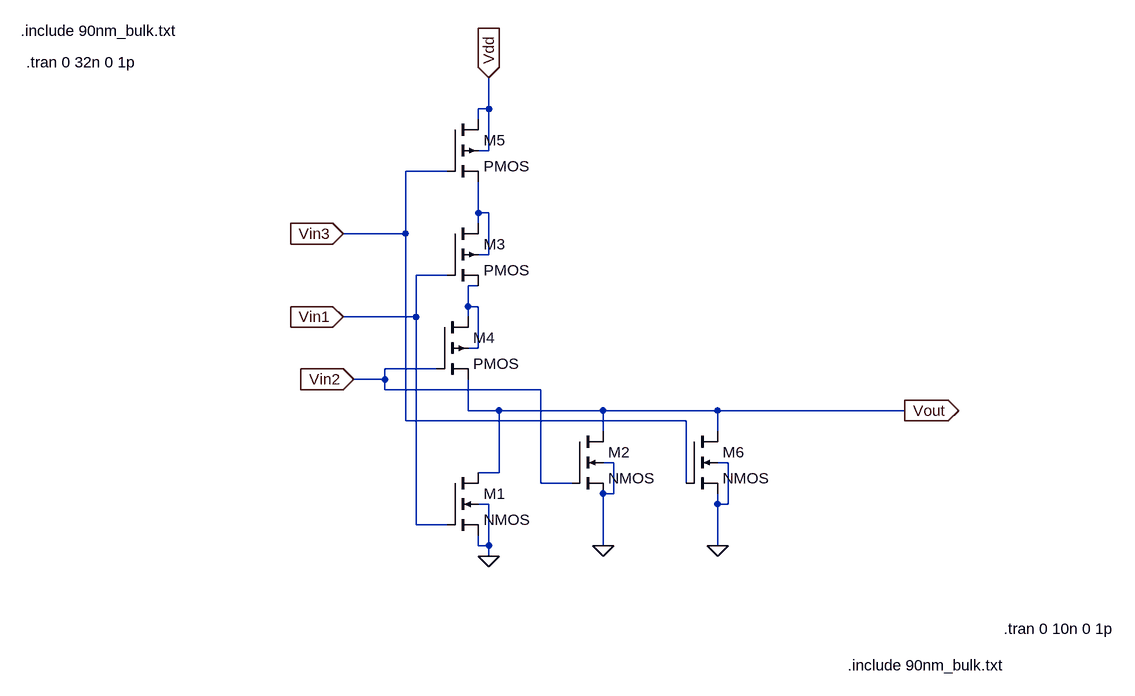
[diagram p0: schematic nor3.asc]
nor3.asc, the LTspice schematic file:
Version 4
SHEET 1 968 680
WIRE -720 -592 -720 -640
WIRE -720 -592 -736 -592
WIRE -736 -576 -736 -592
WIRE -720 -528 -720 -592
WIRE -720 -528 -736 -528
WIRE -784 -496 -848 -496
WIRE -736 -432 -736 -480
WIRE -720 -432 -736 -432
WIRE -736 -416 -736 -432
WIRE -848 -400 -848 -496
WIRE -848 -400 -944 -400
WIRE -720 -368 -720 -432
WIRE -720 -368 -736 -368
WIRE -784 -336 -832 -336
WIRE -736 -320 -752 -320
WIRE -752 -288 -752 -320
WIRE -736 -288 -752 -288
WIRE -832 -272 -832 -336
WIRE -832 -272 -944 -272
WIRE -752 -272 -752 -288
WIRE -736 -224 -736 -288
WIRE -736 -224 -752 -224
WIRE -800 -192 -880 -192
WIRE -880 -176 -880 -192
WIRE -880 -176 -928 -176
WIRE -880 -160 -880 -176
WIRE -640 -160 -880 -160
WIRE -752 -128 -752 -176
WIRE -704 -128 -752 -128
WIRE -544 -128 -704 -128
WIRE -368 -128 -544 -128
WIRE -80 -128 -368 -128
WIRE -848 -112 -848 -400
WIRE -416 -112 -848 -112
WIRE -544 -96 -544 -128
WIRE -368 -96 -368 -128
WIRE -528 -48 -544 -48
WIRE -352 -48 -368 -48
WIRE -704 -32 -704 -128
WIRE -704 -32 -736 -32
WIRE -640 -16 -640 -160
WIRE -592 -16 -640 -16
WIRE -416 -16 -416 -112
WIRE -528 0 -528 -48
WIRE -528 0 -544 0
WIRE -720 16 -736 16
WIRE -368 16 -368 0
WIRE -352 16 -352 -48
WIRE -352 16 -368 16
WIRE -832 48 -832 -272
WIRE -784 48 -832 48
WIRE -736 80 -736 64
WIRE -720 80 -720 16
WIRE -720 80 -736 80
WIRE -544 80 -544 0
WIRE -368 80 -368 16
WIRE -720 96 -720 80
FLAG -944 -272 Vin1
IOPIN -944 -272 In
FLAG -928 -176 Vin2
IOPIN -928 -176 In
FLAG -80 -128 Vout
IOPIN -80 -128 Out
FLAG -720 -640 Vdd
IOPIN -720 -640 In
FLAG -944 -400 Vin3
IOPIN -944 -400 In
FLAG -368 80 0
FLAG -544 80 0
FLAG -720 96 0
SYMBOL nmos4 -784 -32 R0
SYMATTR InstName M1
SYMATTR Value2 l=90n w=200n
SYMBOL nmos4 -592 -96 R0
SYMATTR InstName M2
SYMATTR Value2 l=90n w=200n
SYMBOL pmos4 -784 -416 R0
SYMATTR InstName M3
SYMATTR Value2 l=90n w=400n
SYMBOL pmos4 -800 -272 R0
SYMATTR InstName M4
SYMATTR Value2 l=90n w=400n
SYMBOL pmos4 -784 -576 R0
SYMATTR InstName M5
SYMATTR Value2 l=90n w=400n
SYMBOL nmos4 -416 -96 R0
SYMATTR InstName M6
SYMATTR Value2 l=90n w=200n
TEXT -168 264 Left 2 !.include 90nm_bulk.txt
TEXT 72 208 Left 2 !.tran 0 10n 0 1p
TEXT -1440 -712 Left 2 !.include 90nm_bulk.txt
TEXT -1432 -664 Left 2 !.tran 0 32n 0 1p

The netlist it stands for:
* nor3.asc
M1 Vout Vin1 0 0 NMOS l=90n w=200n
M2 Vout Vin2 0 0 NMOS l=90n w=200n
M3 N001 Vin1 N002 N001 PMOS l=90n w=400n
M4 N002 Vin2 Vout N002 PMOS l=90n w=400n
M5 Vdd Vin3 N001 Vdd PMOS l=90n w=400n
M6 Vout Vin3 0 0 NMOS l=90n w=200n
.model NMOS NMOS
.model PMOS PMOS
.lib standard.mos
.include 90nm_bulk.txt
.tran 0 10n 0 1p
.include 90nm_bulk.txt
.tran 0 32n 0 1p
.backanno
.end